# EAGLE design SensorTCRT5000 (EAGLE 7.3.0)
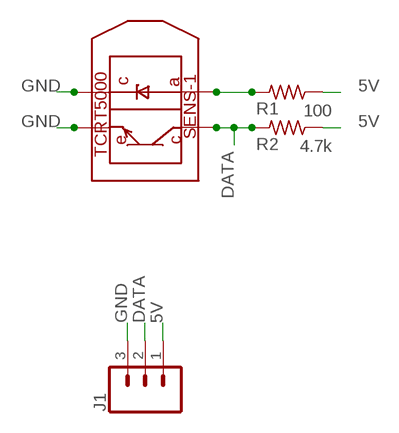
[diagram p0: schematic, sheet 1]

## Parts
J1  CONN_03  [1X03]
R1  100  R-US_0207/10  [0207/10]
R2  4.7k  R-US_0207/10  [0207/10]
SENS-1  TCRT5000  [5000]

## Nets
5V: J1.1 R1.1 R2.1
DATA: J1.2 R2.2 SENS-1.P$1
GND: J1.3 SENS-1.P$2 SENS-1.P$4
N$1: R1.2 SENS-1.P$3

## Library data of the parts
J1 = SparkFun-Connectors:CONN_03: Multi connection point. Often used as Generic Header-pin footprint for 0.1 inch spaced/style header connections On any of the 0.1 inch spaced packages, you can populate with these: Break Away Headers - Straight <https://www.sparkfun.com/products/116> (PRT-00116) Break Away Male Headers - Right Angle <https://www.sparkfun.com/products/553> (PRT-00553) Female Headers <https://www.sparkfun.com/products/115> (PRT-00115) Break Away Headers - Machine Pin <https://www.sparkfun.com/products/117> (PRT-00117) Break Away Female Headers - Swiss Machine Pin <https://www.sparkfun.com/products/743> (PRT-00743) Stackable Header - 3 Pin (Female, 0.1") <https://www.sparkfun.com/products/13875> (PRT-13875) For SCREWTERMINALS and SPRING TERMINALS visit here: Screw Terimnals on SparkFun.com <https://www.sparkfun.com/search/results?term=Screw+Terminals> (5mm/3.5mm/2.54mm spacing) This device is also useful as a general connection point to wire up your design to another part of your project. Our various solder wires solder well into these plated through hole pads. Hook-Up Wire - Assortment (Stranded, 22 AWG) <https://www.sparkfun.com/products/11375> (PRT-11375) Hook-Up Wire - Assortment (Solid Core, 22 AWG) <https://www.sparkfun.com/products/11367> (PRT-11367) View the entire wire category on our website here <https://www.sparkfun.com/categories/141> Special notes: Molex polarized connector foot print use with SKU : PRT-08232 with associated crimp pins and housings.
R1 R2 = adafruit:R-US_: RESISTOR, American symbol
SENS-1 = TCRT5000:TCRT5000: Reflective Optical Sensor with Transistor Output. Vishay Semiconductors

## Board
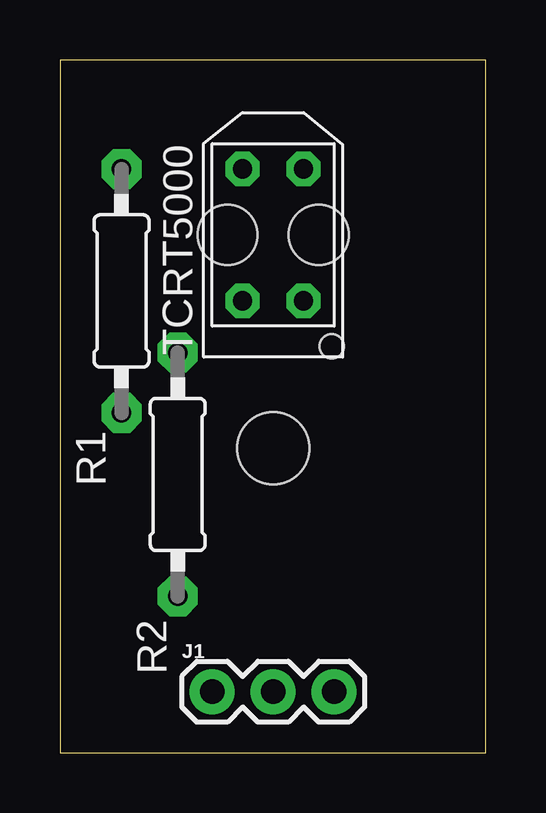
[diagram p1: board, top side]
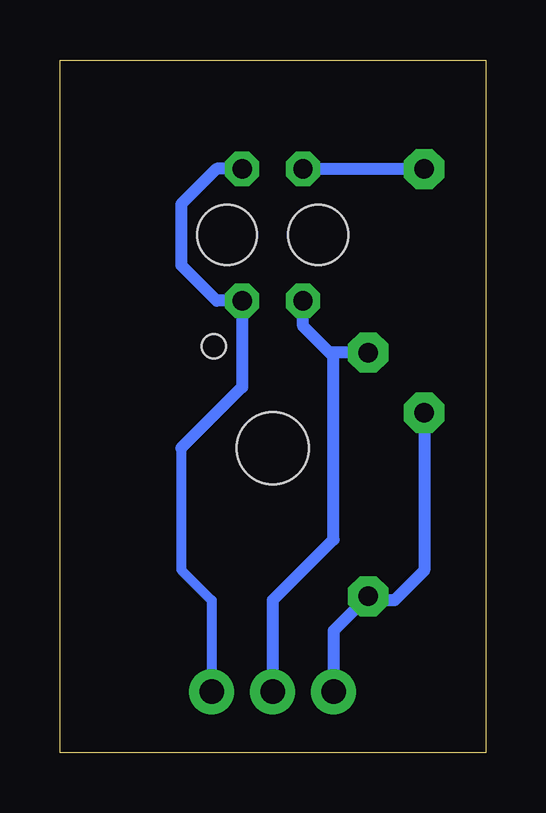
[diagram p2: board, bottom side, seen from below]

Size 17.76 x 28.88 mm. Coordinates in mm from the lower left corner, seen from the top.
Outline: 0,0 17.76,0 17.76,28.88 0,28.88 0,0
Copper layers (1*16): Top 0.035mm / dielectric 1.5mm / Bottom 0.035mm
Design rules "default": minimum track width 10mil, minimum drill 24mil, track to track 8mil, track to pad 8mil, pad to pad 8mil, via to via 8mil, smd to smd 8mil, copper to edge 40mil, drill to drill 8mil, minimum pad ring 10mil, minimum via ring 8mil, stop-mask expansion 4mil, vias tented up to drill 0mil, thermal gap 10mil
Holes 3 mm at 8.89,12.7

### Footprints (pad centres in the part's own frame; a part is rotated, then mirrored left to right if it is on the bottom)
1X03 = drill 1.016 pad 1.88: 1 0,0; 2 2.54,0; 3 5.08,0
0207/10 = drill 0.813 pad 1.676 octagon: 1 -5.08,0; 2 5.08,0
5000 = drill 0.8 pad 1.422 octagon: P$1 -2.75,1.27; P$2 -2.75,-1.27; P$3 2.75,1.27; P$4 2.75,-1.27 | hole 2.5: 0,1.9; 0,-1.9 | hole 1: -4.65,-2.45

### Placement (x,y rotation side)
J1  6.35,2.54 0 top
R1  2.57,19.25 90 top
R2  4.91,11.6 90 top
SENS-1  8.89,21.59 90 top

### Tracks (layer width: path | path; a pad name or v marks a point on that pad's centre or on a via)
5V
  Bottom 0.5: R1.1 2.57,7.59 3.81,6.35 4.74,6.35 R2.1 6.35,5.08 J1.1
DATA
  Bottom 0.5: R2.2 6.35,16.68 | 6.35,16.68 6.52,16.68 7.62,17.78 SENS-1.P$1 | 6.35,16.68 6.35,8.89 8.89,6.35 J1.2
GND
  Bottom 0.406: 12.7,12.7 12.7,7.62 11.43,6.35 J1.3
  Bottom 0.5: SENS-1.P$4 11.22,24.34 12.7,22.86 12.7,20.32 11.22,18.84 SENS-1.P$2 10.16,15.24 12.7,12.7
N$1
  Bottom 0.5: R1.2 SENS-1.P$3